# Altium project FODSMainBoard.PrjPcb
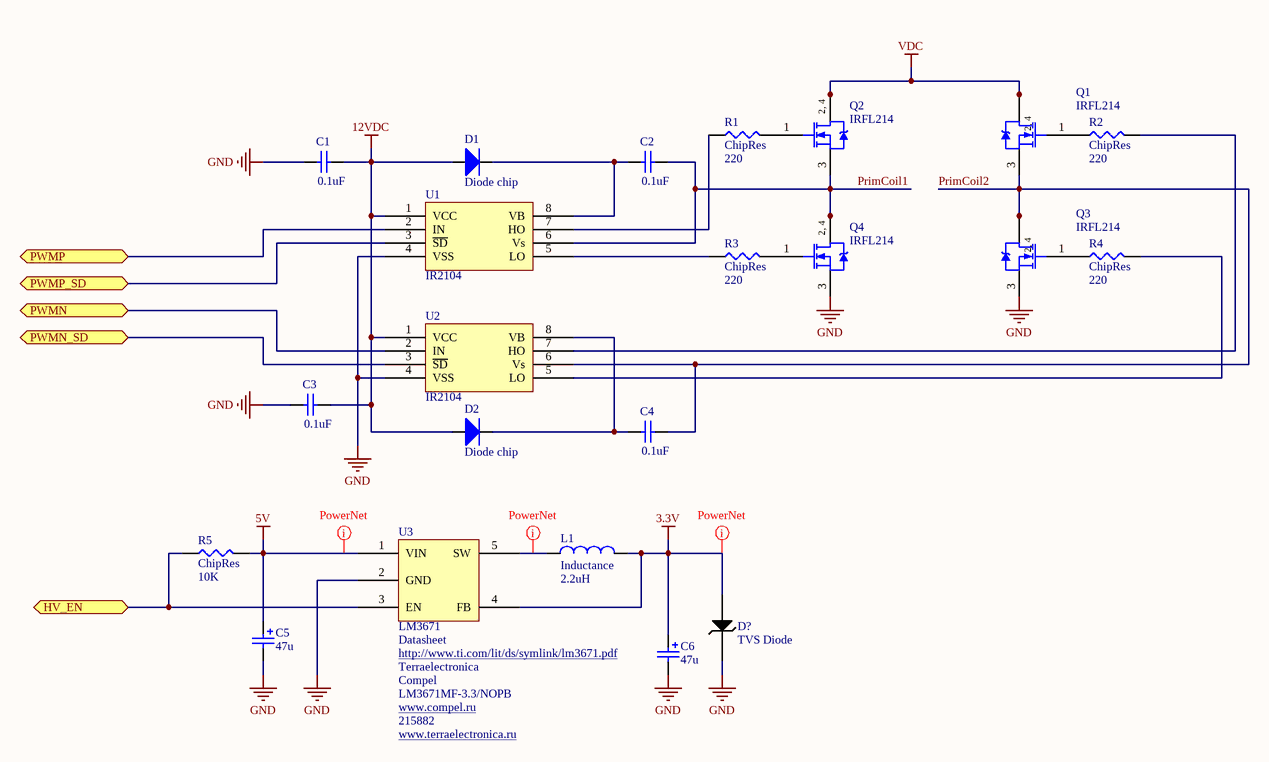
[diagram p0: HVSource.SchDoc]
1 sheet, 22 parts. Net scope: flat (ports and power ports of the same name join across sheets).

## Sheet HVSource.SchDoc
size A3

### Parts
C1  value 0.1uF  [CAP0805]  (hidden comment: ChipCap)
C2  value 0.1uF  [CAP0805]  (hidden comment: ChipCap)
C3  value 0.1uF  [CAP0805]  (hidden comment: ChipCap)
C4  value 0.1uF  [CAP0805]  (hidden comment: ChipCap)
C5  value 47u  [CAPC7343]  (hidden comment: Cap Pol SMD)
C6  value 47u  [CAPC7343]  (hidden comment: Cap Pol SMD)
D1  Diode chip  [SMB1]
D2  Diode chip  [SMB1]
D?  TVS Diode  [DO-214AS]
L1  Inductance  value 2.2uH  [CDRH2D14]
Q1  IRFL214  [SOT-223_N]
Q2  IRFL214  [SOT-223_N]
Q3  IRFL214  [SOT-223_N]
Q4  IRFL214  [SOT-223_N]
R1  ChipRes  value 220  [RES0805]
R2  ChipRes  value 220  [RES0805]
R3  ChipRes  value 220  [RES0805]
R4  ChipRes  value 220  [RES0805]
R5  ChipRes  value 10K  [RES0805]
U1  IR2104  [SOIC8]
U2  IR2104  [SOIC8]
U3  LM3671  ComponentLink1Description: Datasheet  Supplier 1: Terraelectronica  Supplier 2: Compel  Supplier Part Number 2: LM3671MF-3.3/NOPB  Supplier Part Number 1: 215882  [SOT23-5]

### Ports
HV_EN, PWMN, PWMN_SD, PWMP, PWMP_SD

### Nets
3.3V: C6.1 D?.2 L1.1 U3.4(FB)
5V: C5.1 R5.2 U3.1(VIN)
12VDC: C1.2 C3.2 D1.1(A) D2.1(A) U1.1(VCC) U2.1(VCC)
GND: C1.1 C3.1 C5.2 C6.2 D?.1 Q3.3(S) Q4.3(S) U1.4(VSS) U2.4(VSS) U3.2(GND)
VDC: Q1.2(D) Q1.4(D) Q2.2(D) Q2.4(D)
PrimCoil1: C2.2 Q2.3(S) Q4.2(D) Q4.4(D) U1.6(Vs)
PrimCoil2: C4.2 Q1.3(S) Q3.2(D) Q3.4(D) U2.6(Vs)
NetC2_1: C2.1 D1.2(K) U1.8(VB)
NetC4_1: C4.1 D2.2(K) U2.8(VB)
NetL1_2: L1.2 U3.5(SW)
NetQ1_1: Q1.1(G) R2.1
NetQ2_1: Q2.1(G) R1.2
NetQ3_1: Q3.1(G) R4.1
NetQ4_1: Q4.1(G) R3.2
NetR1_1: R1.1 U1.7(HO)
NetR2_2: R2.2 U2.7(HO)
NetR3_1: R3.1 U1.5(LO)
NetR4_2: R4.2 U2.5(LO)
NetR5_1: R5.1 U3.3(EN) ; port HV_EN
NetU1_2: U1.2(IN) ; port PWMP
NetU1_3: U1.3(~{SD}) ; port PWMP_SD
NetU2_2: U2.2(IN) ; port PWMN
NetU2_3: U2.3(~{SD}) ; port PWMN_SD

### Layout directives
net class Undefined: 3.3V, 5V, NetL1_2

### Notes on the sheet
- (in symbol IRFL214) 2, 4

### Library data of the parts
C1-C4 = ChipCap: Capacitor; Published: 8-Jun-2000; LatestRevisionDate: 17-Jul-2002; LatestRevisionNote: Re-released for DXP Platform.; PackageReference: RAD-0.3; Publisher: Altium Limited
C5 C6 = Cap Pol Chip: Polarized Capacitor (Radial); Supplier 1: Digi-Key; Supplier Part Number 1: 399-4029-1-ND
D1 D2 = Diode chip: Voltage: 1000V; Current (continuous): 3A; Current (peak, sine 8,3 ms): 150V; Junction capacitance: 50pF
D? = TVS Diode SMA
L1 = ChipInductance
Q1-Q4 = IRFL214: HEXFET Power MOSFET; Note: Pin 2 is electrically connected to pin 4.; Published: 8-Jun-2000; LatestRevisionDate: 20-Nov-2009; LatestRevisionNote: IPC-7351 Footprint Added.; DatasheetVersion: PD-9.862; PackageReference: SOT-223; Publisher: Altium Limited; PackageDescription: 4-Pin SOT-223 Package 2.3 mm Pitch, 7 mm Lead Span; Code_JEDEC: TO-261-AA; Code_IPC: SOT223-4; ComponentLink1Description: Manufacturer Link; ComponentLink1URL: http://www.irf.com/; ComponentLink2Description: Datasheet; ComponentLink2URL: http://www.irf.com/product-info/datasheets/data/irfl214.pdf
R1-R5 = ChipRes: Chip resistor
U1 U2 = IR2104: IR MOSFET Driver
U3 = LM3671MF: 600-mA Step-Down DC-DC Converter; ComponentLink1URL: http://www.ti.com/lit/ds/symlink/lm3671.pdf; Supplier URL 2: www.compel.ru; Supplier URL 1: www.terraelectronica.ru